# Altium schematic sheet IMUCubePIN_Sch.SchDoc: Template
size A4; Author: Hom; CompanyName: KitSprout; DrawnBy: Hom; Engineer: Hom; Organization: KitSprout; Revision: A; SheetNumber: 1; SheetTotal: 1; Version: 0.0; LibVersion: 0.0
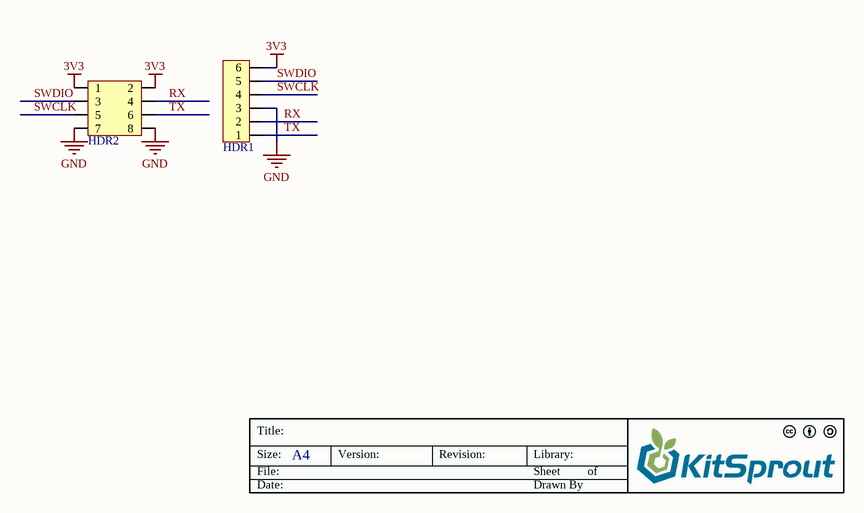
[diagram p0: IMUCubePIN_Sch.SchDoc]

## Parts
HDR1  HDR1x6_1.27  [HDR1X6_1.27_180H]  (value not drawn)
HDR2  HDR2x4_2.54  [HDR2X4_2.54_180H]  (value not drawn)

## Nets
3V3: HDR1.6 HDR2.1 HDR2.2
GND: HDR1.3 HDR2.7 HDR2.8
RX: HDR1.2 HDR2.4
SWCLK: HDR1.4 HDR2.5
SWDIO: HDR1.5 HDR2.3
TX: HDR1.1 HDR2.6

## Notes on the sheet
- Title:
- Size:
- Date:
- File:
- A4
- Version:
- Revision:
- Sheet
- Drawn By
- Library:
- of

## Library data of the parts
HDR1 = HDR1x6_1.27: Header
HDR2 = HDR2x4_2.54: Header